# Altium schematic sheet e3_ej4_sche.SchDoc
size A4
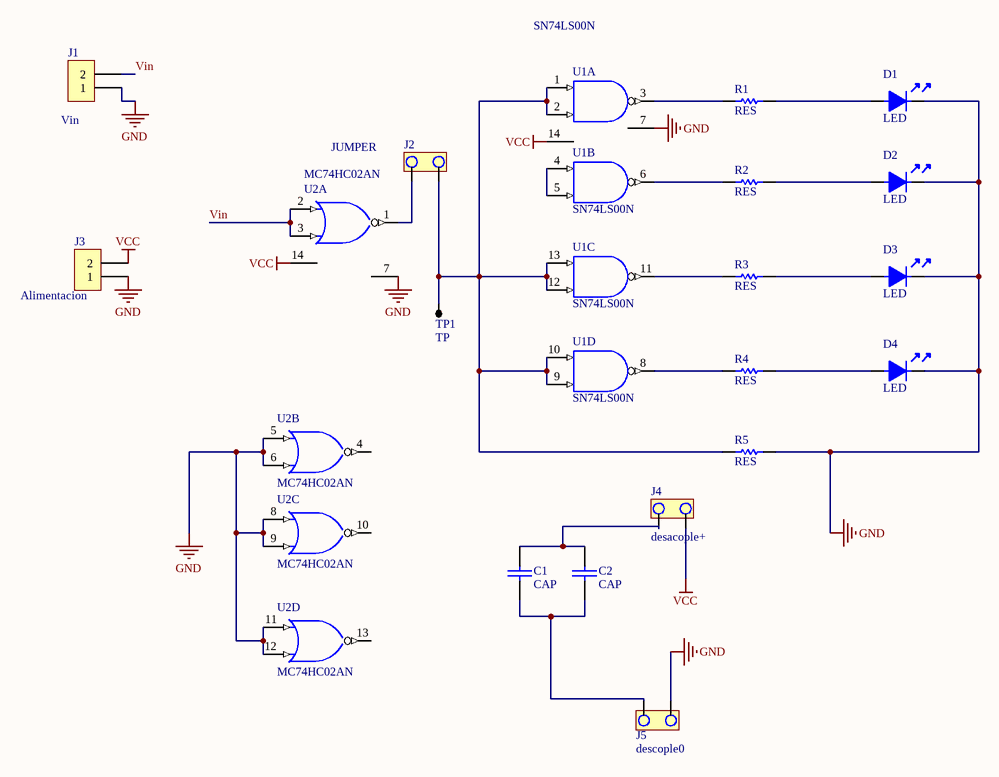
[diagram p0: e3_ej4_sche.SchDoc]

## Parts
C1  CAP  [CAP200]
C2  CAP  [CAP200]
D1  LED  [LED3]
D2  LED  [LED3]
D3  LED  [LED3]
D4  LED  [LED3]
J1  Vin  [BORNERA2]
J2  JUMPER  [JUMPER2]
J3  Alimentacion  [BORNERA2]
J4  desacople+  [JUMPER2]
J5  descople0  [JUMPER2]
R1  RES  [RES400]
R2  RES  [RES400]
R3  RES  [RES400]
R4  RES  [RES400]
R5  RES  [RES400]
TP1  TP  [TPTH]
U1  SN74LS00N  [646-06]  (parts A,B,C,D of 4)
U2  MC74HC02AN  [646-06]  (parts A,B,C,D of 4)

## Nets
GND: D1.2 D2.2 D3.2 D4.2 J1.1 J3.1 J5.2 R5.2 U1.7(GND) U2.5(A) U2.6(B) U2.7(GND) U2.8(A) U2.9(B) U2.11(A) U2.12(B)
VCC: J3.2 J4.1 U1.14(VCC) U2.14(VCC)
Vin: J1.2 U2.2(A) U2.3(B)
NetC1_1: C1.1 C2.1 J4.2
NetC1_2: C1.2 C2.2 J5.1
NetD1_1: D1.1 R1.2
NetD2_1: D2.1 R2.2
NetD3_1: D3.1 R3.2
NetD4_1: D4.1 R4.2
NetJ2_1: J2.1 R5.1 TP1.1 U1.1(A) U1.2(B) U1.9(B) U1.10(A) U1.12(B) U1.13(A)
NetJ2_2: J2.2 U2.1(~{Y})
NetR1_1: R1.1 U1.3(~{O})
NetR2_1: R2.1 U1.6(~{O})
NetR3_1: R3.1 U1.11(~{O})
NetR4_1: R4.1 U1.8(~{O})
NetU1_4: U1.4(A) U1.5(B)

Not connected (* = marked no-connect by the designer): U2 4(~{Y}) 10(~{Y}) 13(~{Y})

## Library data of the parts
J1 J3 = BORNERA 2
J4 J5 = JUMPER
U1 = SN74LS00N: Quad 2-Input NAND Gate; ComponentAvailability: Not for New Design; Published: 15-Apr-2002; DatasheetVersion: Dec-1999; PackageVersion: 1995; PackageReference: 646-06; Publisher: Altium Limited; PackageDescription: DIP; 14 Leads; Row Spacing 7.62 mm; Pitch 2.54 mm; ComponentLink1Description: Manufacturer Link; ComponentLink1URL: http://www.onsemi.com/; ComponentLink2Description: Datasheet; ComponentLink2URL: http://www.onsemi.com/pub/Collateral/SN74LS00-D.PDF
U2 = MC74HC02AN: Quad 2-Input NOR Gate; Published: 15-Apr-2002; DatasheetVersion: Mar-2000; PackageVersion: 1995; PackageReference: 646-06; Publisher: Altium Limited; PackageDescription: DIP; 14 Leads; Row Spacing 7.62 mm; Pitch 2.54 mm; ComponentLink1Description: Manufacturer Link; ComponentLink1URL: http://www.onsemi.com/; ComponentLink2Description: Datasheet; ComponentLink2URL: http://www.onsemi.com/pub/Collateral/MC74HC02A-D.PDF